# EAGLE design Switch de potencia (EAGLE 9.6.2)
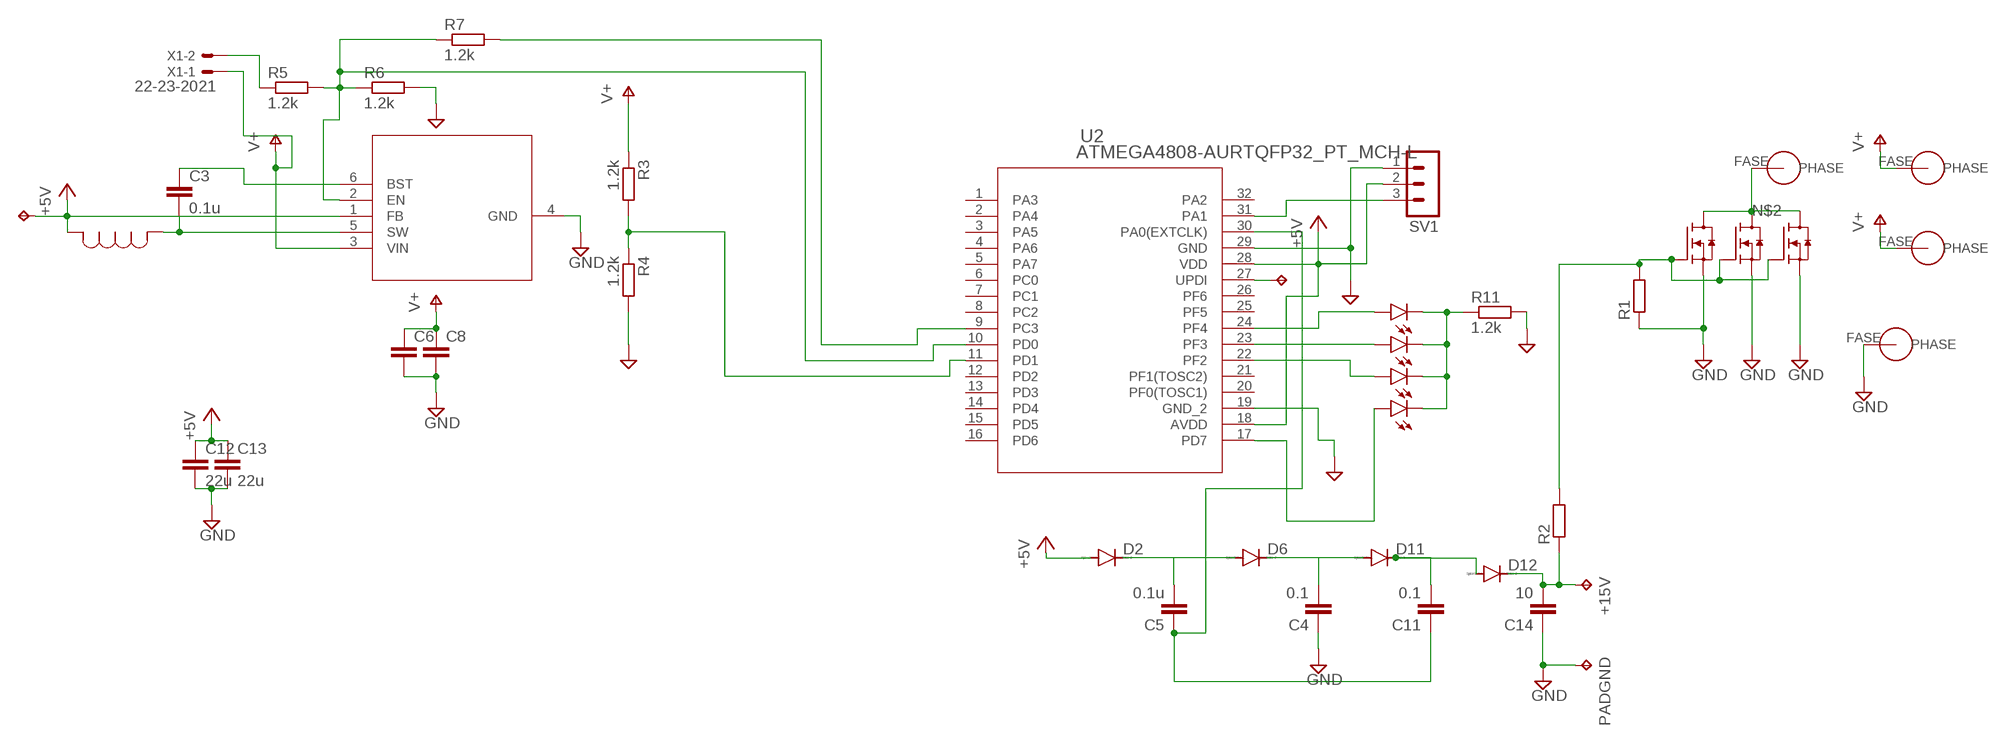
[diagram p0: schematic, sheet 1]

## Parts
+15V  TPB1,27  [B1,27]
C3  0.1u  C-EUC0402  [C0402]
C4  0.1  C-EUC0805  [C0805]
C5  0.1u  C-EUC0805  [C0805]
C6  C-EUC0805  [C0805]
C8  C-EUC0805  [C0805]
C11  0.1  C-EUC0805  [C0805]
C12  22u  C-EUC0402  [C0402]
C13  22u  C-EUC0402  [C0402]
C14  10  C-EUC0805  [C0805]
D2  DIODE-MINIMELF  [MINIMELF]
D6  DIODE-MINIMELF  [MINIMELF]
D11  DIODE-MINIMELF  [MINIMELF]
D12  DIODE-MINIMELF  [MINIMELF]
GND  PHASE  [POWEROUT]
LA1  IPB180N06S4-H1  [PG-TO263-7-3]
LA2  IPB180N06S4-H1  [PG-TO263-7-3]
LA3  IPB180N06S4-H1  [PG-TO263-7-3]
OUTPUT  PHASE  [POWEROUT]
PADGND  TPB1,27  [B1,27]
POWERON2  LEDCHIPLED_0603  [CHIPLED_0603]
POWERON3  LEDCHIPLED_0603  [CHIPLED_0603]
POWERON4  LEDCHIPLED_0603  [CHIPLED_0603]
POWERON5  LEDCHIPLED_0603  [CHIPLED_0603]
R1  R-EU_R0603  [R0603]
R2  R-EU_R0603  [R0603]
R3  1.2k  R-EU_M0805  [M0805]
R4  1.2k  R-EU_M0805  [M0805]
R5  1.2k  R-EU_M0805  [M0805]
R6  1.2k  R-EU_M0805  [M0805]
R7  1.2k  R-EU_M0805  [M0805]
R11  1.2k  R-EU_M0805  [M0805]
SV1  MA03-1  [MA03-1]
TP1  TPB1,27  [B1,27]
TP9  TPB1,27  [B1,27]
U2  ATMEGA4808-AURTQFP32_PT_MCH-L  [TQFP32_PT_MCH-L]
U3  AP63205WU-7SOIC_05WU-7_DIO-M  [SOIC_05WU-7_DIO-M]
U$1  INDUCTOR4.7  [IND_NRS5030T100MMGJ_TAY]
V+  PHASE  [POWEROUT]
V+1  PHASE  [POWEROUT]
X1  22-23-2021  [22-23-2021]

## Nets
+5V: C12.1 C13.1 D2.A SV1.2 TP9.TP U2.18(AVDD) U2.28(VDD) U3.1(FB) U$1.1
GND: C4.1 C6.2 C8.2 C12.2 C13.2 C14.1 GND.FASE(PHASE) LA1.2(S) LA1.3(S) LA1.5(S) LA1.6(S) LA1.7(S) LA2.2(S) LA2.3(S) LA2.5(S) LA2.6(S) LA2.7(S) LA3.2(S) LA3.3(S) LA3.5(S) LA3.6(S) LA3.7(S) PADGND.TP R1.1 R4.2 R6.2 R11.2 SV1.1 U2.19(GND_2) U2.29(GND) U3.4(GND)
N$1: LA1.1(G) LA2.1(G) LA3.1(G) R1.2 R2.2
N$2: LA1.8(D) LA2.8(D) LA3.8(D) OUTPUT.FASE(PHASE)
N$3: TP1.TP U2.27(UPDI)
N$4: POWERON3.A U2.24(PF4)
N$5: POWERON2.A U2.23(PF3)
N$6: POWERON5.A U2.22(PF2)
N$7: +15V.TP C14.2 D12.C R2.1
N$8: C5.2 D2.C D6.A
N$9: R5.1 X1.2
N$10: R3.2 R4.1 U2.11(PD1)
N$11: POWERON4.A U2.17(PD7)
N$12: SV1.3 U2.31(PA1)
N$14: POWERON2.C POWERON3.C POWERON4.C POWERON5.C R11.1
N$15: C3.2 U3.5(SW) U$1.2
N$17: R5.2 R6.1 R7.1 U2.10(PD0) U3.2(EN)
N$18: R7.2 U2.9(PC3)
N$20: C5.1 C11.1 U2.30(PA0(EXTCLK))
N$22: C3.1 U3.6(BST)
N$39: C4.2 D6.C D11.A
N$40: C11.2 D11.C D12.A
V+: C6.1 C8.1 R3.1 U3.3(VIN) V+1.FASE(PHASE) V+.FASE(PHASE) X1.1
Unconnected: U2.1(PA3) U2.2(PA4) U2.3(PA5) U2.4(PA6) U2.5(PA7) U2.6(PC0) U2.7(PC1) U2.8(PC2) U2.12(PD2) U2.13(PD3) U2.14(PD4) U2.15(PD5) U2.16(PD6) U2.20(PF0(TOSC1)) U2.21(PF1(TOSC2)) U2.25(PF5) U2.26(PF6) U2.32(PA2)

## Library data of the parts
+15V PADGND TP1 TP9 = testpad:TP: Test pad
C3-C6 C8 C11-C14 = rcl:C-EU: CAPACITOR, European symbol; SPICEPREFIX: C
D2 D6 D11 D12 = diode:DIODE-: DIODE
GND OUTPUT V+ V+1 = PHASE:PHASE
LA1-LA3 = infineon:IPB180N06S4-H1: OptiMOS®-T2 Power-Transistor Source: 1859075.pdf (Farnell)
POWERON2-POWERON5 = led:LED: LED OSRAM: - CHIPLED LG R971, LG N971, LY N971, LG Q971, LY Q971, LO R971, LY R971 LH N974, LH R974 LS Q976, LO Q976, LY Q976 LO Q996 - Hyper CHIPLED LW Q18S LB Q993, LB Q99A, LB R99A - SideLED LS A670, LO A670, LY A670, LG A670, LP A670 LB A673, LV A673, LT A673, LW A673 LH A674 LY A675 LS A676, LA A676, LO A676, LY A676, LW A676 LS A679, LY A679, LG A679 - Hyper Micro SIDELED® LS Y876, LA Y876, LO Y876, LY Y876 LT Y87S - SmartLED LW L88C, LW L88S LB L89C, LB L89S, LG L890 LS L89K, LO L89K, LY L89K LS L896, LA L896, LO L896, LY L896 - TOPLED LS T670, LO T670, LY T670, LG T670, LP T670 LSG T670, LSP T670, LSY T670, LOP T670, LYG T670 LG T671, LOG T671, LSG T671 LB T673, LV T673, LT T673, LW T673 LH T674 LS T676, LA T676, LO T676, LY T676, LB T676, LH T676, LSB T676, LW T676 LB T67C, LV T67C, LT T67C, LS T67K, LO T67K, LY T67K, LW E67C LS E67B, LA E67B, LO E67B, LY E67B, LB E67C, LV E67C, LT E67C LW T67C LS T679, LY T679, LG T679 LS T770, LO T770, LY T770, LG T770, LP T770 LB T773, LV T773, LT T773, LW T773 LH T774 LS E675, LA E675, LY E675, LS T675 LS T776, LA T776, LO T776, LY T776, LB T776 LHGB T686 LT T68C, LB T68C - Hyper Mini TOPLED® LB M676 - Mini TOPLED Santana® LG M470 LS M47K, LO M47K, LY M47K Source: http://www.osram.convergy.de LUXEON: - LUMILED® LXK2-PW12-R00, LXK2-PW12-S00, LXK2-PW14-U00, LXK2-PW14-V00 LXK2-PM12-R00, LXK2-PM12-S00, LXK2-PM14-U00 LXK2-PE12-Q00, LXK2-PE12-R00, LXK2-PE12-S00, LXK2-PE14-T00, LXK2-PE14-U00 LXK2-PB12-K00, LXK2-PB12-L00, LXK2-PB12-M00, LXK2-PB14-N00, LXK2-PB14-P00, LXK2-PB14-Q00 LXK2-PR12-L00, LXK2-PR12-M00, LXK2-PR14-Q00, LXK2-PR14-R00 LXK2-PD12-Q00, LXK2-PD12-R00, LXK2-PD12-S00 LXK2-PH12-R00, LXK2-PH12-S00 LXK2-PL12-P00, LXK2-PL12-Q00, LXK2-PL12-R00 Source: www.luxeon.com KINGBRIGHT: KA-3528ASYC Source: www.kingbright.com
R1-R7 R11 = rcl:R-EU_: RESISTOR, European symbol; SPICEPREFIX: R
SV1 = con-lstb:MA03-1: PIN HEADER; OC_FARNELL: unknown; OC_NEWARK: unknown
U2 = Atmega4808:ATMEGA4808-AUR; BUILT_BY: EMA_Cory; COPYRIGHT: Copyright (C) 2018 Accelerated Designs. All rights reserved; DATASHEET: https://ww1.microchip.com/downloads/en/DeviceDoc/ATmega4808-09-DataSheet-DS40002173B.pdf; MANUFACTURER_PART_NUMBER: ATMEGA4808-AUR; SOURCELIBRARY: Add_to_database_2021-02-15; VENDOR: Microchip
U3 = AP63205WU-7:AP63205WU-7; BUILT_BY: EMA_Matt; COPYRIGHT: Copyright (C) 2018 Accelerated Designs. All rights reserved; MANUFACTURER_PART_NUMBER: AP63205WU-7; SOURCELIBRARY: Diodes_Inc_2019-12-05; VENDOR: Diodes Inc
U$1 = Inductor4.7:INDUCTOR4.7
X1 = con-molex:22-23-2021: .100" (2.54mm) Center Header - 2 Pin; MF: MOLEX; MPN: 22-23-2021; OC_FARNELL: 1462926; OC_NEWARK: 25C3832

## Board
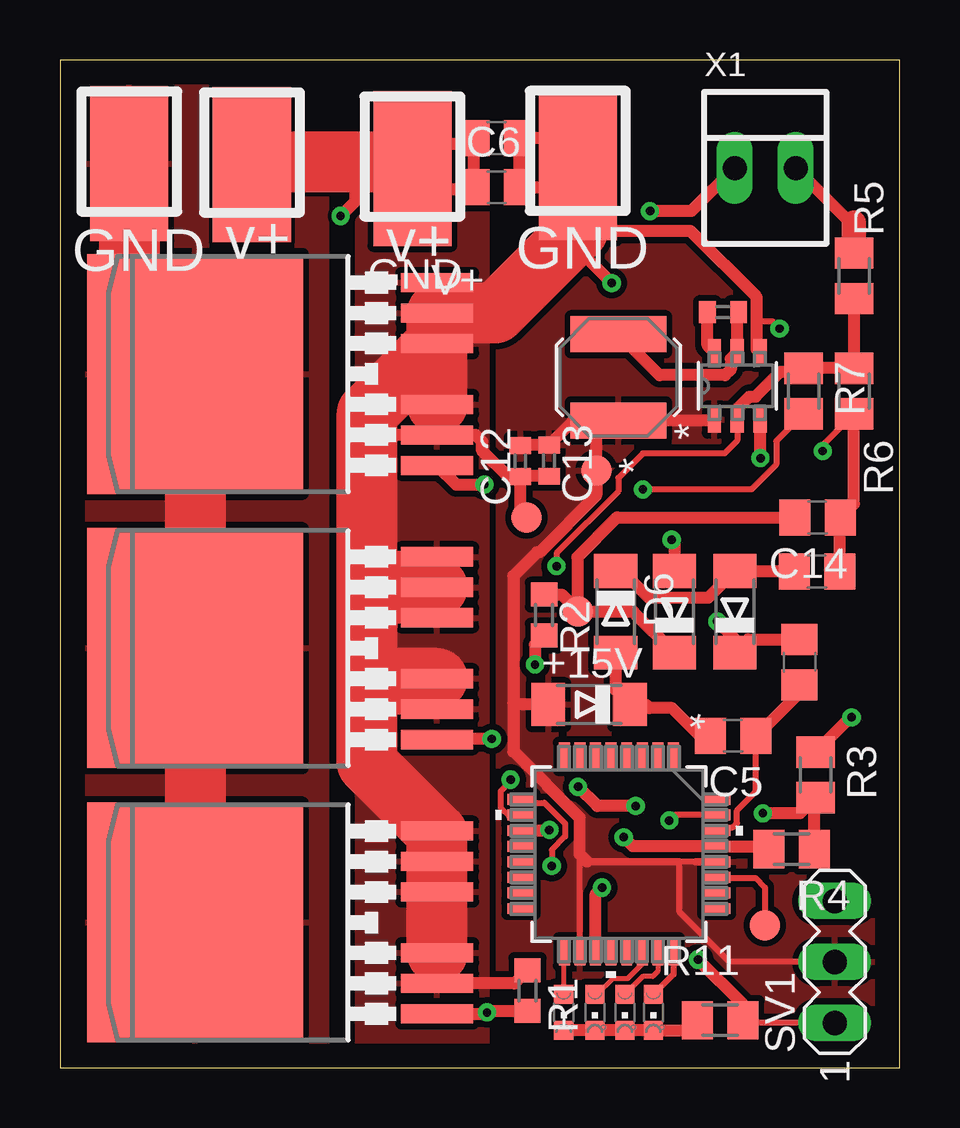
[diagram p1: board, top side]
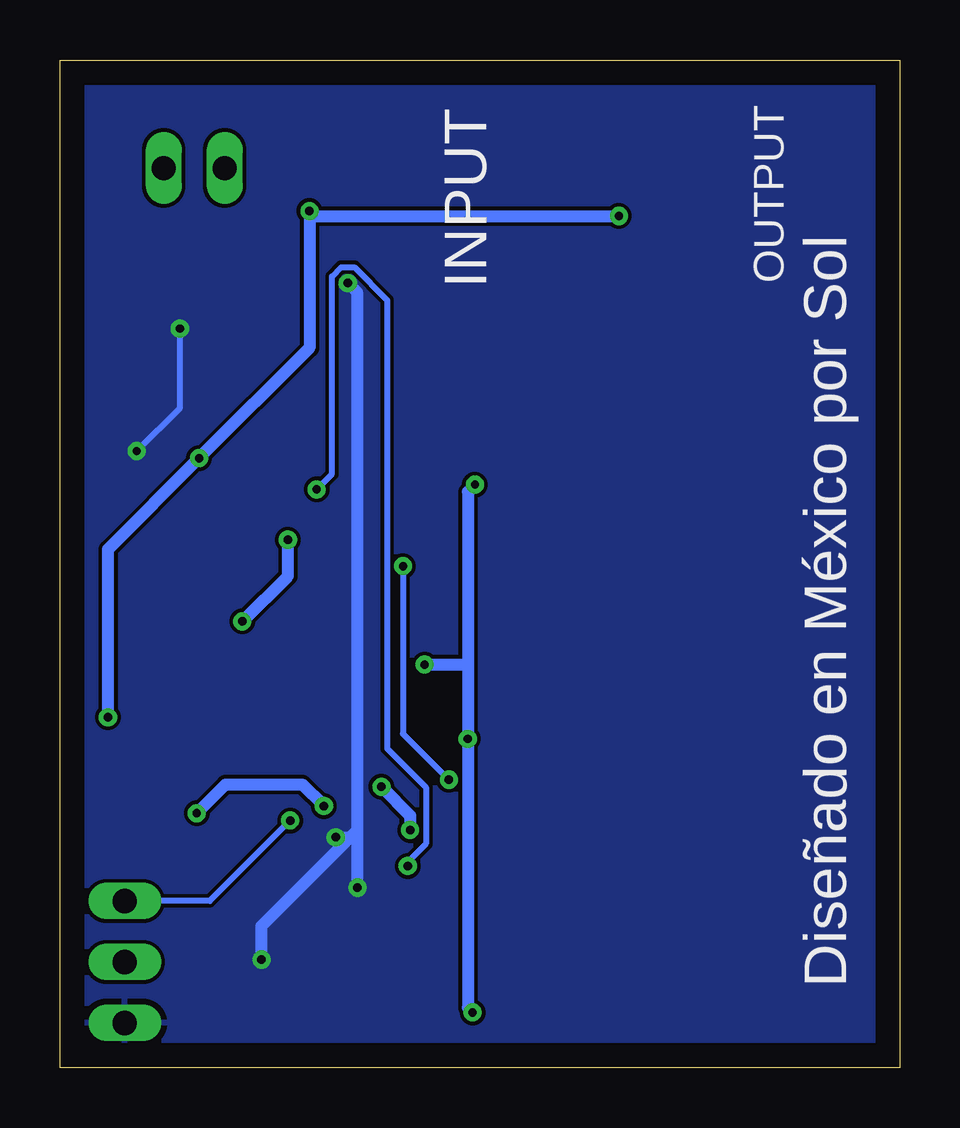
[diagram p2: board, bottom side, seen from below]

Size 35 x 42 mm. Coordinates in mm from the lower left corner, seen from the top.
Outline: 0,0 35,0 35,42 0,42 0,0
Copper layers (1*16): Top 0.035mm / dielectric 1.5mm / Bottom 0.035mm
Design rules "default": minimum track width 6mil, minimum drill 0.35mm, track to track 6mil, track to pad 6mil, pad to pad 6mil, via to via 6mil, smd to smd 6mil, copper to edge 40mil, drill to drill 6mil, minimum pad ring 10mil, minimum via ring 8mil, stop-mask expansion 4mil, vias tented up to drill 0mil, thermal gap 10mil

### Footprints (pad centres in the part's own frame; a part is rotated, then mirrored left to right if it is on the bottom)
B1,27 = smd 1.27 x 1.27: TP 0,0
C0402 = smd 0.7 x 0.9: 1 -0.65,0; 2 0.65,0
C0805 = smd 1.3 x 1.5: 1 -0.95,0; 2 0.95,0
MINIMELF = smd 1.4 x 1.8: A 1.7,0; C -1.7,0
POWEROUT = smd 3.251 x 6.452: FASE 0,0
PG-TO263-7-3 = smd 0.8 x 3: 1 -3.81,-9.207; 2 -2.54,-9.207; 3 -1.27,-9.207; 5 1.27,-9.207; 6 2.54,-9.207; 7 3.81,-9.207 | smd 10 x 9: 8 0,0.895
CHIPLED_0603 = smd 0.8 x 0.8: A 0,-0.75; C 0,0.75
R0603 = smd 1 x 1.1: 1 -0.85,0; 2 0.85,0
M0805 = smd 1.3 x 1.6: 1 -0.95,0; 2 0.95,0
MA03-1 = drill 1.016 long: 1 -2.54,0; 2 0,0; 3 2.54,0
TQFP32_PT_MCH-L = smd 1.141 x 0.457: 1 -4.075,2.275; 2 -4.075,1.625; 3 -4.075,0.975; 4 -4.075,0.325; 5 -4.075,-0.325; 6 -4.075,-0.975; 7 -4.075,-1.625; 8 -4.075,-2.275; 17 4.075,-2.275; 18 4.075,-1.625; 19 4.075,-0.975; 20 4.075,-0.325; 21 4.075,0.325; 22 4.075,0.975; 23 4.075,1.625; 24 4.075,2.275 | smd 0.457 x 1.141: 9 -2.275,-4.075; 10 -1.625,-4.075; 11 -0.975,-4.075; 12 -0.325,-4.075; 13 0.325,-4.075; 14 0.975,-4.075; 15 1.625,-4.075; 16 2.275,-4.075; 25 2.275,4.075; 26 1.625,4.075; 27 0.975,4.075; 28 0.325,4.075; 29 -0.325,4.075; 30 -0.975,4.075; 31 -1.625,4.075; 32 -2.275,4.075
SOIC_05WU-7_DIO-M = smd 1.096 x 0.557: 1 -1.399,0.95; 2 -1.399,0; 3 -1.399,-0.95; 4 1.399,-0.95; 5 1.399,0; 6 1.399,0.95
IND_NRS5030T100MMGJ_TAY = smd 1.499 x 3.988: 1 -1.8,0; 2 1.8,0
22-23-2021 = drill 1 long: 1 -1.27,0; 2 1.27,0

### Placement (x,y rotation side)
+15V  21.6,19.02 0 top
C3  27.64,31.49 0 top
C4  31.56,20.68 180 top
C5  28.06,13.83 180 top
C6  18.2,36.69 0 top
C8  18.2,38.74 0 top
C11  30.83,16.9 90 top
C12  19.19,25.28 270 top
C13  20.39,25.3 270 top
C14  31.58,22.93 180 top
D2  22.06,15.13 180 top
D6  23.17,19 270 top
D11  28.13,19 90 top
D12  25.61,19 90 top
GND  21.59,37.71 180 top
LA1  6.52,28.91 90 top
LA2  6.52,17.48 90 top
LA3  6.52,6.05 90 top
OUTPUT  2.89,37.68 180 top
PADGND  19.45,22.92 0 top
POWERON2  23.55,2.3 180 top
POWERON3  24.74,2.3 180 top
POWERON4  21,2.3 180 top
POWERON5  22.3,2.3 180 top
R1  19.49,3.21 270 top
R2  20.18,18.86 270 top
R3  31.5,12.2 270 top
R4  30.5,9.1 180 top
R5  33.1,33 270 top
R6  33.1,28.2 270 top
R7  31,28.2 270 top
R11  27.52,1.97 0 top
SV1  32.3,4.4 90 top
TP1  29.39,5.93 270 top
TP9  22.36,24.89 0 top
U2  23.3,8.9 270 top
U3  28.23,28.41 90 top
U$1  23.28,28.77 90 top
V+  14.69,37.47 180 top
V+1  8,37.64 180 top
X1  29.4,37.5 0 top

### Tracks (layer width: path | path; a pad name or v marks a point on that pad's centre or on a via)
+5V
  Top 0.254: U2.18 21.68,8.88 21.66,8.9 | SV1.2 27.91,4.4 25.83,6.48 25.83,8.57 26.5,8.57
  Top 0.305: 21.98,8.57 25.83,8.57 | U2.28 26.5,8.57
  Top 0.508: 22.3,26.97 U$1.1 27.24,26.97 U3.1 | 22.3,26.97 21.41,26.97 C13.1 19.21,25.95 C12.1 | 22.3,26.97 22.36,26.91 TP9.TP 22.36,23.86 19.98,21.48 19.88,21.48 18.9,20.5 18.9,15.2 | 18.9,15.2 18.9,13.17 21.66,10.41 21.66,8.9 21.98,8.57 | D2.A 18.97,15.13 18.9,15.2
  pour Top (isolate 0.254): 18.3,0 18.3,42 35,42 35,0
GND  (via drill 0.35)
  Top 0.254: R6.2 31.8,25.95 v31.8,25.7 | v30,30.8 29.7,31.1 29.05,31.1 | SV1.1 28.58,1.86 R11.2
  Top 0.508: R1.1 18.94,3.51 LA3.2 | LA2.2 13.56,14.94 12.8,15.7 | LA2.5 13.05,18.75 12.8,18.5 | LA2.7 13.79,21.29 12.8,20.3 | 12.8,27.29 13.72,26.37 LA1.2 17.33,26.37 17.6,26.1 17.6,25.7 17.63,25.67 18.67,24.63 C12.2 | 21.59,34.87 26.28,34.87 29.05,32.11 29.05,31.1 29.05,29.94 U3.4 | C13.2 19.21,24.65 C12.2 | 21.59,36.99 21,36.4 20.71,36.69 C6.2 C8.2 20.56,38.74 GND.FASE 21.59,34.89 21.59,34.11 v23,32.7 | PADGND.TP 19.19,23.18 C12.2 | U2.19 22.32,7.22 v22.6,7.5 | R11.2 28.47,2.63 v26.6,4.5 | v23.5,9.6 23.88,9.22 U2.29 29.43,9.22 R4.2 | C4.1 32.51,22.91 C14.1 33.1,23.5 R6.2
  Top 2.54: LA3.3 15.73,9.76 12.8,12.68 12.8,15.7 | 15.73,30.21 LA1.6 18.15,31.45 21.59,34.89 21.59,36.99 GND.FASE | 15.73,30.21 12.8,27.29 12.8,20.3 | 12.8,15.7 12.8,18.5 12.8,20.3 | LA1.3 15.73,30.21 | LA2.3 13.31,16.21 12.8,15.7 | LA2.6 13.09,20.02 12.8,20.3
  Bottom 0.254: v31.8,25.7 30,27.5 v30,30.8
  Bottom 0.508: v22.6,7.5 22.6,9.8 | 22.6,9.8 22.6,9.9 | 22.6,9.9 22.6,32.3 v23,32.7 | v26.6,4.5 26.6,5.9 22.6,9.9 | v23.5,9.6 22.8,9.6 22.6,9.8
  pour Bottom: 0,0 0,42 35,42 35,0
  pour Top (isolate 0.254): 12.4,42 12.4,0 17.8,0 17.8,42
N$1  (via drill 0.35)
  Top 0.508: LA1.1 16.53,24.3 v17.7,24.3 | LA2.1 15.76,13.7 v18,13.7 | LA3.1 17.74,2.24 v17.8,2.3 17.86,2.36 R1.2 | R2.2 19.8,17.63 v19.8,16.8
  Bottom 0.508: v17.7,24.3 18,24 18,16.8 | 18,16.8 v18,13.7 18,2.5 v17.8,2.3 | v19.8,16.8 18,16.8
N$2
  Top 2.54: 5.25,16.21 5.62,16.59 5.62,27.6 | 5.25,6.42 LA3.8 | LA1.8 5.62,27.6 | LA2.8 5.62,4.92 5.4,4.7 3.75,6.35 | OUTPUT.FASE 2.89,30.34 5.62,27.6
  pour Top: 0,0 0,41.9 11.1,41.9 11.1,0
N$3
  Top 0.254: U2.27 27.4,7.9 29,7.9 29.39,7.51 TP1.TP
N$4
  Top 0.254: U2.24 25.57,3.88 POWERON3.A
N$5
  Top 0.203: POWERON2.A 24.3,3.8 24.71,3.8 24.93,4.02 U2.23
N$6
  Top 0.203: U2.22 24.31,4.79 24.31,4.35 23.66,3.7 23.05,3.7 22.39,3.05 POWERON5.A
N$7
  Top 0.508: R2.1 20.91,19.71 +15V.TP | +15V.TP 23.89,19.02 D12.C | +15V.TP 21.56,19.06 21.56,21.27 23.23,22.93 C14.2
N$8
  Top 0.508: C5.2 26.67,13.83 25.52,14.98 24.57,14.98 24.43,15.13 D2.C 23.17,15.72 D6.A
N$9
  Top 0.508: X1.2 33.1,35.07 R5.1
  Top 1.016: 33.1,35.23 R5.1
N$10  (via drill 0.35)
  Top 0.508: R4.1 31.45,11.2 R3.2 30.85,10.6 v29.3,10.6 | v24,10.9 22.4,10.9 v21.6,11.7 | v20.4,9.9 20.38,9.88 U2.11
  Bottom 0.508: v29.3,10.6 28.1,11.8 24.9,11.8 v24,10.9 | v21.6,11.7 20.4,10.5 v20.4,9.9
N$11
  Top 0.2: POWERON4.A 21,4.8 U2.17
N$12  (via drill 0.35)
  Top 0.254: U2.31 25.62,10.53 v25.4,10.3
  Bottom 0.254: v25.4,10.3 28.76,6.94 SV1.3
N$14
  Top 0.508: POWERON4.C POWERON5.C POWERON2.C POWERON3.C 26.15,1.55 R11.1
N$15
  Top 0.508: C3.2 28.23,31.43 U3.5 27.96,29.54 27.96,29.09 27.73,28.86 25,28.86 U$1.2
N$17  (via drill 0.35)
  Top 0.254: U3.2 28.23,26.13 27.7,25.6 24.3,25.6 23.27,24.57 23.27,24.02 20.7,21.44 v20.7,20.9 | U2.10 19.17,10.47 18.74,10.47 18.38,10.83 18.38,11.52 18.79,11.93 v18.79,12
  Top 0.508: R5.2 R6.1 R7.1 30.86,29.01 30.03,29.01 28.99,27.96 28.73,27.96 28.23,27.46 U3.2
  Bottom 0.254: v20.7,20.9 20.7,13.91 v18.79,12
N$18  (via drill 0.35)
  Top 0.254: U2.9 19.37,11.03 20.2,11.03 21.06,10.17 21.06,9.63 20.5,9.07 v20.5,8.4 | R7.2 29.86,26.11 29.86,25.13 28.83,24.1 v24.3,24.1
  Bottom 0.254: v20.5,8.4 20.5,8.57 19.74,9.33 19.74,11.68 21.36,13.3 21.36,31.99 22.73,33.36 23.27,33.36 23.66,32.97 23.66,24.74 v24.3,24.1
N$20
  Top 0.254: C5.1 29.01,13.8 29.01,11.51 28.23,10.72 28.23,10.18 28.06,10.02 27.52,10.02 U2.30
  Top 0.508: C11.1 30.83,15.62 29.01,13.8
N$22
  Top 0.508: U3.6 26.99,30.1 C3.1
N$39
  Top 0.508: D6.C 23.43,20.7 24.54,19.59 27.02,19.59 D11.A 30.59,20.7 C4.2
N$40  (via drill 0.35)
  Top 0.508: C11.2 28.68,17.85 D11.C 28.13,17.87 v27.4,18.6 | v25.5,22 25.61,21.89 D12.A
  Bottom 0.508: v27.4,18.6 25.5,20.5 v25.5,22
V+  (via drill 0.35)
  Top 0.508: v11.7,35.5 12.3,36.1 12.3,37.74 | 14.3,38.3 14.3,38.1 | 14.3,38.1 14.3,37.4 | 14.3,38.1 14.7,38.5 17.01,38.5 C8.1 C6.1 17.16,36.6 14.3,36.6 14.3,37.08 V+.FASE | v29.2,25.4 29.2,26.99 U3.3 | R3.1 32.95,14.6 v33,14.6 | X1.1 26.33,35.7 v24.6,35.7
  Top 2.54: V+.FASE 14.42,37.74 12.3,37.74 8.39,37.74 V+1.FASE
  Bottom 0.508: v11.7,35.5 24.4,35.5 v24.6,35.7 24.6,30 v29.2,25.4 33,21.6 v33,14.6

### Text on the board
tPlace: v+ | v+ | GND | GND
bPlace: INPUT | Diseñado en México por Sol